# Altium schematic sheet gydrodrive_debugger.SchDoc
size 297 x 209 mm; SheetNumber: 9; SheetTotal: 22
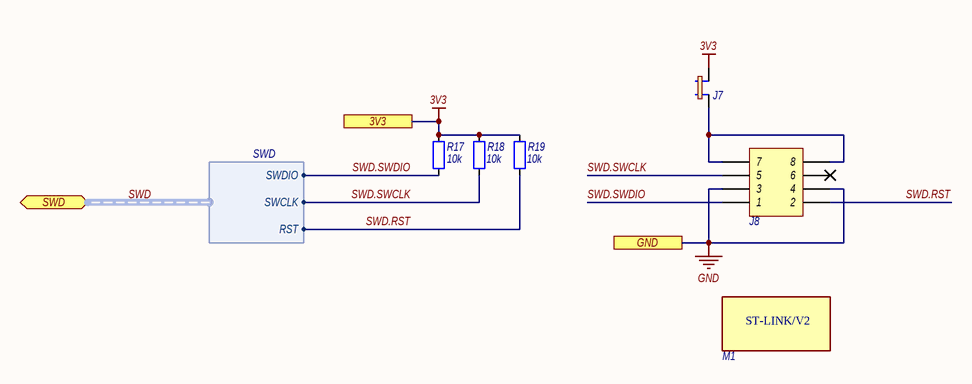
[diagram p0: gydrodrive_debugger.SchDoc]

## Parts
J7  PLS-2.54-2 JUMP  [PLS-2-2.54]  (value not drawn)
J8  PBD-2.54-08R  [PBD-8R]  (value not drawn)
M1  ST-LINK/V2  [ST_LINK_V2_MINI]  (value not drawn)
R17  Resistance: 10k  [RESC2012-0805M]  (hidden comment: RES_0805)
R18  Resistance: 10k  [RESC2012-0805M]  (hidden comment: RES_0805)
R19  Resistance: 10k  [RESC2012-0805M]  (hidden comment: RES_0805)

## Ports
3V3 (see gydrodrive_main[4A], gydrodrive_button[2B], gydrodrive_can[3B], gydrodrive_encoder[1A], gydrodrive_indication[3C], gydrodrive_inputTrim[2B], gydrodrive_interfaces[3C], gydrodrive_mcu[4C], gydrodrive_rs485[4B], gydrodrive_sto[2B], gydrodrive_supply[5B]), GND (see gydrodrive_main[4A], gydrodrive_button[2C], gydrodrive_can[3C], gydrodrive_control[2C], gydrodrive_currentSource[2B], gydrodrive_discreteControl[3B], gydrodrive_encoder[1B], gydrodrive_i2c[5C], gydrodrive_indication[3C], gydrodrive_inputTrim[2C], gydrodrive_interfaces[3A], gydrodrive_linearPosSensor[2C], gydrodrive_mcu[6D], gydrodrive_reservedPins[2C], gydrodrive_rs485[3B], gydrodrive_sensor[3C], gydrodrive_sensors[2B], gydrodrive_sto[2C], gydrodrive_supply[2C], gydrodrive_uart[4C]), SWD (bidir, harness SWD, see gydrodrive_main[3A], gydrodrive_mcu[1C])

## Harnesses
SWD: SWDIO, SWCLK, RST

## Nets
3V3: J7.2 R17.2 R18.2 R19.2 ; port 3V3
GND: J8.3 J8.4 ; port GND
SWD.RST: J8.2 R19.1 ; port SWD.RST
SWD.SWCLK: J8.5 R18.1 ; port SWD.SWCLK
SWD.SWDIO: J8.1 R17.1 ; port SWD.SWDIO
NetJ7_1: J7.1 J8.7 J8.8

Not connected (* = marked no-connect by the designer): J8 6*

## Buses and harness runs
harness SWD = port SWD

## Notes on the sheet
- Подп. и дата
- Инв. № дубл.
- Взам. инв. №
- Инв. № подл.
- Изм.
- Лист
- № докум.
- Подп.
- Дата
- Копировал
- Формат
- A4

## Library data of the parts
J7 = PLS-2.54-2 JUMP: Разъем штыревой шаг 2.54 мм; Part Name: Разъем PLS-2, шаг 2.54 мм; Parameters: 2.54 мм; Max Price: 10; System: Connector; Part Number: PLS-2.54-2 JUMP; Component Type: Standart; Pin Count: 2
J8 = PBD-2.54-08R: Разъем; Part Name: Разъем PBD-8R, шаг 2.54 мм; Parameters: 2.54 мм; Max Price: 0; System: Connector; Part Number: PBD-2.54-08R; Component Type: Standart; Pin Count: 8
M1 = ST-LINK/V2: Программатор; Part Name: Программатор ST-LINK/V2 (mini) Waveshare 10053; Max Price: 2000; Part Number: ST-LINK/V2; Component Type: Standart
R17-R19 = RESC_0805: Рез-р, корпус 0805; Tolerance: 5%; Parameters: 10k, 5%; Max Price: 3; Part Number: RESC_0805; Part Name: ='Рез-р 0805, ' + Parameters; Component Type: Standart